# Altium schematic sheet PCB_PortSwitcher1D.SchDoc
size A4; Organization: Altium Limited; Address1: L3, 12a Rodborough Rd; Address2: Frenchs Forest; Address3: NSW; Address4: Australia 2086; DocumentNumber: 1; SheetNumber: 1; SheetTotal: 7
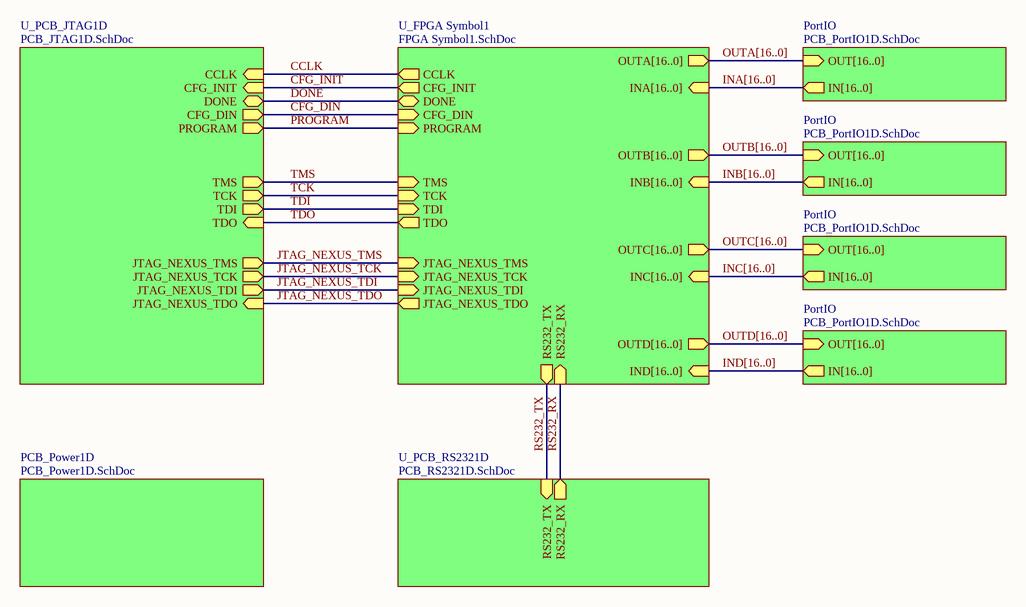
[diagram p0: PCB_PortSwitcher1D.SchDoc]

## Sub-sheets
PCB_Power1D = PCB_Power1D.SchDoc: no entries
PortIO = PCB_PortIO1D.SchDoc: OUT[16..0] (in), IN[16..0] (out)
PortIO = PCB_PortIO1D.SchDoc: OUT[16..0] (in), IN[16..0] (out)
PortIO = PCB_PortIO1D.SchDoc: OUT[16..0] (in), IN[16..0] (out)
PortIO = PCB_PortIO1D.SchDoc: OUT[16..0] (in), IN[16..0] (out)
U_FPGA Symbol1 = FPGA Symbol1.SchDoc: CFG_INIT (out), CFG_DIN (in), PROGRAM (in), DONE (bidir), CCLK (out), TMS (in), TCK (in), TDI (in), JTAG_NEXUS_TMS (in), JTAG_NEXUS_TCK (in), JTAG_NEXUS_TDI (in), JTAG_NEXUS_TDO (out), TDO (out), OUTD[16..0] (out), OUTC[16..0] (out), OUTB[16..0] (out), OUTA[16..0] (out), IND[16..0] (in), INC[16..0] (in), INB[16..0] (in), INA[16..0] (in), RS232_TX (out), RS232_RX (in)
U_PCB_JTAG1D = PCB_JTAG1D.SchDoc: TDO (in), TDI (out), TCK (out), TMS (out), DONE (bidir), PROGRAM (out), CCLK (in), JTAG_NEXUS_TMS (out), JTAG_NEXUS_TCK (out), JTAG_NEXUS_TDI (out), JTAG_NEXUS_TDO (in), CFG_DIN (out), CFG_INIT (in)
U_PCB_RS2321D = PCB_RS2321D.SchDoc: RS232_RX (out), RS232_TX (in)

## Nets
CCLK: sheet U_PCB_JTAG1D/CCLK, sheet U_FPGA Symbol1/CCLK
CFG_DIN: sheet U_PCB_JTAG1D/CFG_DIN, sheet U_FPGA Symbol1/CFG_DIN
CFG_INIT: sheet U_PCB_JTAG1D/CFG_INIT, sheet U_FPGA Symbol1/CFG_INIT
DONE: sheet U_PCB_JTAG1D/DONE, sheet U_FPGA Symbol1/DONE
JTAG_NEXUS_TCK: sheet U_PCB_JTAG1D/JTAG_NEXUS_TCK, sheet U_FPGA Symbol1/JTAG_NEXUS_TCK
JTAG_NEXUS_TDI: sheet U_PCB_JTAG1D/JTAG_NEXUS_TDI, sheet U_FPGA Symbol1/JTAG_NEXUS_TDI
JTAG_NEXUS_TDO: sheet U_PCB_JTAG1D/JTAG_NEXUS_TDO, sheet U_FPGA Symbol1/JTAG_NEXUS_TDO
JTAG_NEXUS_TMS: sheet U_PCB_JTAG1D/JTAG_NEXUS_TMS, sheet U_FPGA Symbol1/JTAG_NEXUS_TMS
PROGRAM: sheet U_PCB_JTAG1D/PROGRAM, sheet U_FPGA Symbol1/PROGRAM
RS232_RX: sheet U_FPGA Symbol1/RS232_RX, sheet U_PCB_RS2321D/RS232_RX
RS232_TX: sheet U_FPGA Symbol1/RS232_TX, sheet U_PCB_RS2321D/RS232_TX
TCK: sheet U_PCB_JTAG1D/TCK, sheet U_FPGA Symbol1/TCK
TDI: sheet U_PCB_JTAG1D/TDI, sheet U_FPGA Symbol1/TDI
TDO: sheet U_PCB_JTAG1D/TDO, sheet U_FPGA Symbol1/TDO
TMS: sheet U_PCB_JTAG1D/TMS, sheet U_FPGA Symbol1/TMS

## Buses and harness runs
bus INA[16..0] = sheet PortIO/IN[16..0] = sheet U_FPGA Symbol1/INA[16..0]
bus INB[16..0] = sheet PortIO/IN[16..0] = sheet U_FPGA Symbol1/INB[16..0]
bus INC[16..0] = sheet PortIO/IN[16..0] = sheet U_FPGA Symbol1/INC[16..0]
bus IND[16..0] = sheet PortIO/IN[16..0] = sheet U_FPGA Symbol1/IND[16..0]
bus OUTA[16..0] = sheet PortIO/OUT[16..0] = sheet U_FPGA Symbol1/OUTA[16..0]
bus OUTB[16..0] = sheet PortIO/OUT[16..0] = sheet U_FPGA Symbol1/OUTB[16..0]
bus OUTC[16..0] = sheet PortIO/OUT[16..0] = sheet U_FPGA Symbol1/OUTC[16..0]
bus OUTD[16..0] = sheet PortIO/OUT[16..0] = sheet U_FPGA Symbol1/OUTD[16..0]

## Notes on the sheet
- Title
- Size:
- Date:
- A4
- Number:
- Time:
- Revision:
- Sheet
- of
- File: